# Altium project APC1_Wireless.PrjPcb
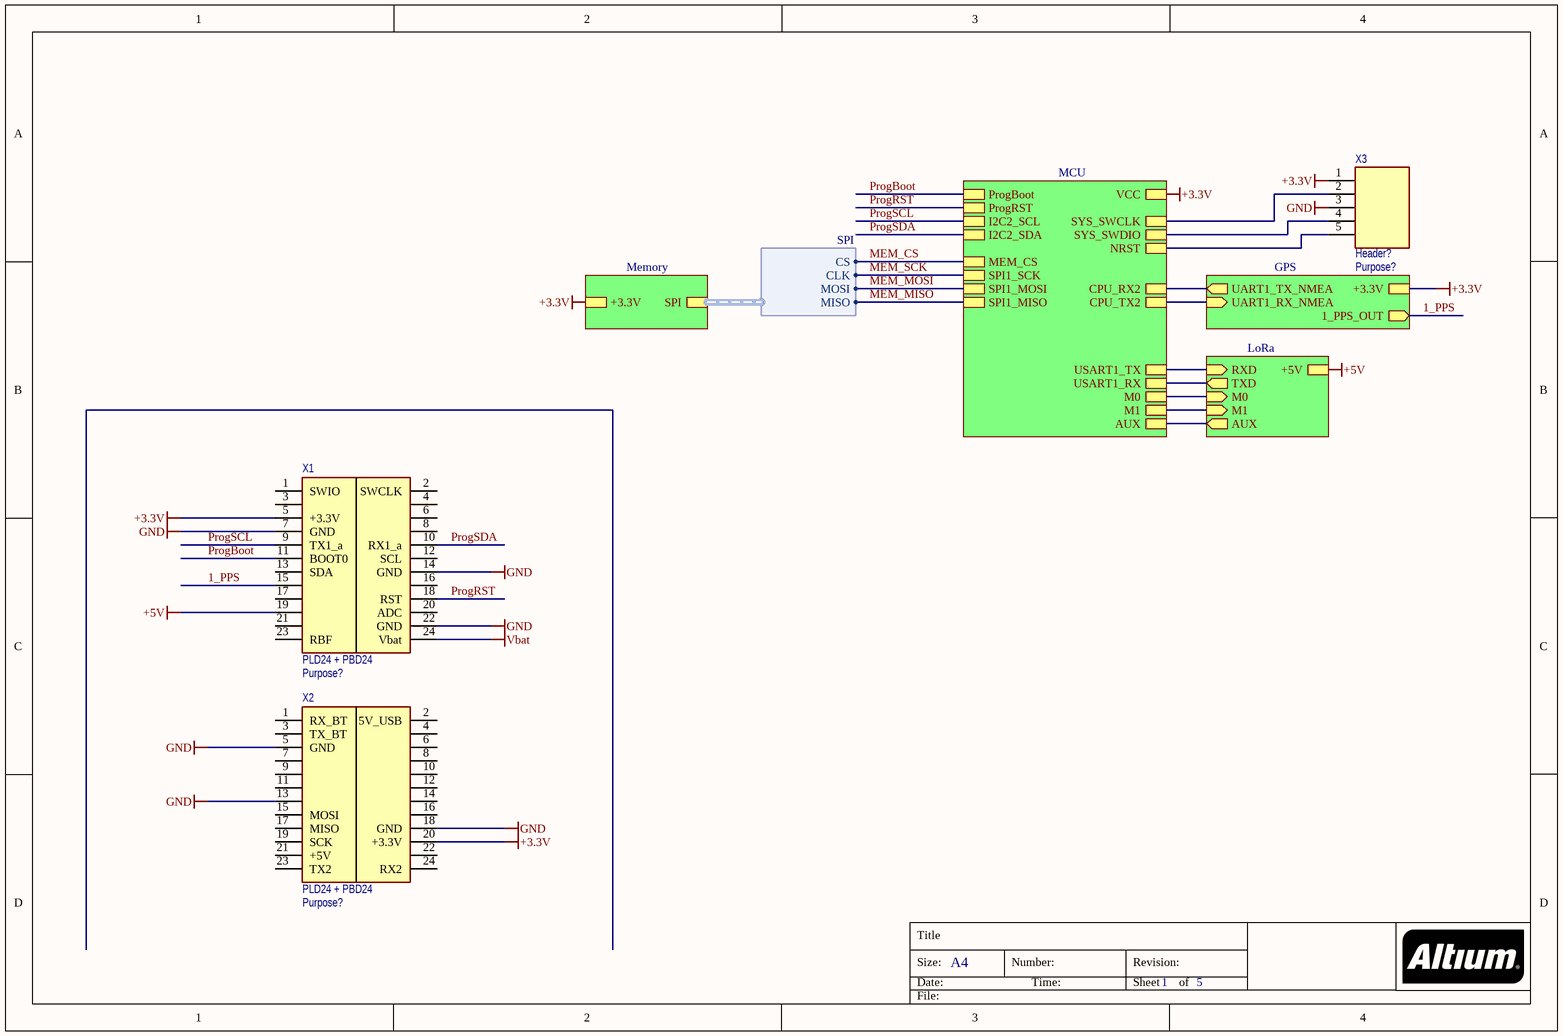
[diagram p0: APC1_Wireless.SchDoc]
5 sheets, 23 parts. Net scope: hierarchical (ports join the sheet entries above them; power ports are global).
Board file: APC1_Wireless.PcbDoc
Sheets:
  APC1_Wireless.SchDoc
    GPS = GPS.SchDoc
    Memory = Memory.SchDoc
    LoRa = LoRa.SchDoc
    MCU = MCU.SchDoc

## Sheet APC1_Wireless.SchDoc: =GlobalProjectName
size A4; ApprovedBy: Утвердил; CheckedBy: Проверил; Author: Разработал; SheetNumber: 1; SheetTotal: 5; PageSetup: Record=PageOptions|CenterHorizontal=True|CenterVertical=True|PrintScale=1.00|XCorrection=1.00|YCorrection=1.00|PrintKind=1|BorderSize=5000000|LeftOffset=0|BottomOffset=0|Orientation=2|PaperLength=1000|PaperWidth=1000|Scale=100|PaperSource=15|PrintQuality=1200|MediaType=1|DitherType=10|PaperKind=A3|PrintScaleMode=1; Weight: -; ScaleFactor: -; NormInspection: Норм.Контр.

### Parts
X1  PLD24 + PBD24  Purpose: Purpose?  [PICOSAT_CNN]
X2  PLD24 + PBD24  Purpose: Purpose?  [PICOSAT_CNN]
X3  Header?  Purpose: Purpose?  [PLS-5R-2.54]

### Sub-sheets
GPS = GPS.SchDoc: 1_PPS_OUT (out), UART1_TX_NMEA (out), UART1_RX_NMEA (in), +3.3V
LoRa = LoRa.SchDoc: M0 (in), RXD (in), M1 (in), TXD (out), AUX (out), +5V
MCU = MCU.SchDoc: VCC, ProgBoot, ProgRST, CPU_RX2, MEM_CS, SPI1_SCK, SPI1_MISO, SPI1_MOSI, SYS_SWDIO, AUX, USART1_TX, USART1_RX, SYS_SWCLK, M0, M1, NRST, CPU_TX2, I2C2_SDA, I2C2_SCL
Memory = Memory.SchDoc: SPI (harness SPI), +3.3V

### Harnesses
SPI: CS, CLK, MOSI, MISO

### Nets
+3.3V: X1.5(+3.3V) X2.20(+3.3V) X3.1 ; sheet GPS/+3.3V, sheet Memory/+3.3V, sheet MCU/VCC
+5V: X1.19 ; sheet LoRa/+5V
GND: X1.7(GND) X1.14(GND) X1.22(GND) X2.5(GND) X2.13 X2.18(GND) X3.3
Vbat: X1.24(Vbat)
1_PPS: X1.15 ; sheet GPS/1_PPS_OUT
AUX: sheet LoRa/AUX, sheet MCU/AUX
M0: sheet LoRa/M0, sheet MCU/M0
M1: sheet LoRa/M1, sheet MCU/M1
MEM_CS: sheet MCU/MEM_CS, sheet Memory/SPI.CS
MEM_MISO: sheet MCU/SPI1_MISO, sheet Memory/SPI.MISO
MEM_MOSI: sheet MCU/SPI1_MOSI, sheet Memory/SPI.MOSI
MEM_SCK: sheet MCU/SPI1_SCK, sheet Memory/SPI.CLK
ProgBoot: X1.11(BOOT0) ; sheet MCU/ProgBoot
ProgRST: X1.18(RST) ; sheet MCU/ProgRST
ProgSCL: X1.9(TX1_a) ; sheet MCU/I2C2_SCL  [project net I2C2_SCL]
ProgSDA: X1.10(RX1_a) ; sheet MCU/I2C2_SDA  [project net I2C2_SDA]
SYS_SWCLK: X3.2 ; sheet MCU/SYS_SWCLK
SYS_SWDIO: X3.4 ; sheet MCU/SYS_SWDIO
USART1_RX: sheet LoRa/TXD, sheet MCU/USART1_RX
USART1_TX: sheet LoRa/RXD, sheet MCU/USART1_TX
USART2_RX: sheet GPS/UART1_TX_NMEA, sheet MCU/CPU_RX2
USART2_TX: sheet GPS/UART1_RX_NMEA, sheet MCU/CPU_TX2
NetR7_1: X3.5 ; sheet MCU/NRST

Not connected (* = marked no-connect by the designer): X1 1(SWIO) 2(SWCLK) 3 4 6 8 12(SCL) 13(SDA) 16 17 20(ADC) 21 23(RBF); X2 1(RX_BT) 2(5V_USB) 3(TX_BT) 4 6 7 8 9 10 11 12 14 15(MOSI) 16 17(MISO) 19(SCK) 21(+5V) 22 23(TX2) 24(RX2)

### Notes on the sheet
- Title
- Size:
- Date:
- A4
- Number:
- Time:
- Revision:
- Sheet
- of
- File:

### Library data of the parts
X1 X2 = Header 2x12: 10x2 header; IsSMT: NoSMT
X3 = Header 1x5: 5x1 header; IsSMT: NoSMT

## Sheet GPS.SchDoc
size A4; SheetNumber: 2; SheetTotal: 5
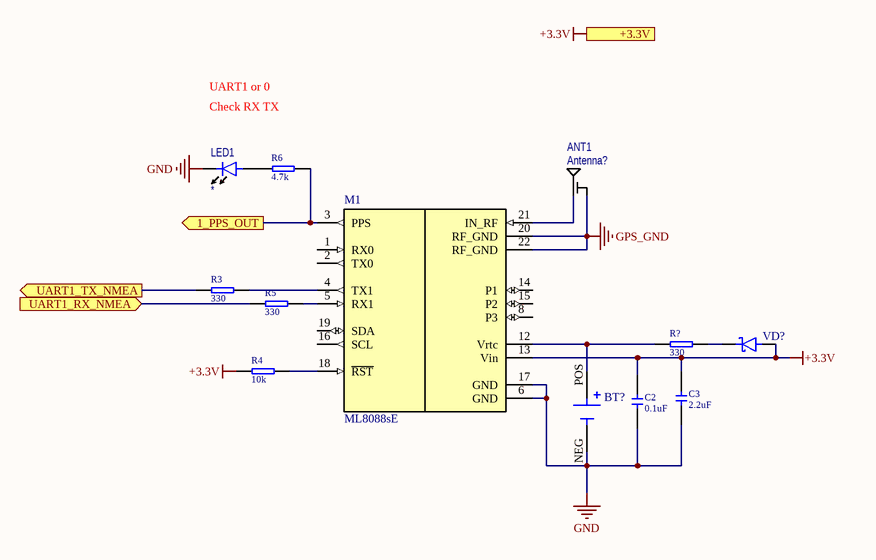
[diagram p1: GPS.SchDoc]

### Parts
ANT1  Antenna?  [IPEX-3P]
BT?  MS621FE-FL11E  [BAT_MS621FE-FL11E]  (value not drawn)
C2  value 0.1uF  [CERCAP 0402]
C3  value 2.2uF  [CERCAP 0603]
LED1  (no value)  [LED 0603]
M1  ML8088sE  [MODULE_ML8088S]
R3  value 330  [RES 0402]
R4  value 10k  [RES 0402]
R5  value 330  [RES 0402]
R6  value 4.7k  [RES 0402]
R?  value 330  [RES 0402]
VD?  (no value)  [SOD-123]

### Ports
1_PPS_OUT (out), +3.3V, UART1_RX_NMEA (in), UART1_TX_NMEA (out)

### Nets
+3.3V: C2.2 C3.2 M1.13(Vin) R4.1 VD?.A(Anode) ; port +3.3V
GND: BT?.NEG C2.1 C3.1 LED1.2(Cathode) M1.6(GND) M1.17(GND)
GPS_GND: ANT1.0 M1.20(RF_GND) M1.22(RF_GND)
1_PPS: M1.3(PPS) R6.2 ; port 1_PPS_OUT
USART2_RX: R3.1 ; port UART1_TX_NMEA
USART2_TX: R5.1 ; port UART1_RX_NMEA
NetANT1_1: ANT1.1 M1.21(IN_RF)
NetBT?_POS: BT?.POS M1.12(Vrtc) R?.1
NetLED1_1: LED1.1(Anode) R6.1
NetM1_4: M1.4(TX1) R3.2
NetM1_5: M1.5(RX1) R5.2
NetM1_18: M1.18(~{RST}) R4.2
NetR?_2: R?.2 VD?.C(Cathode)

Not connected (* = marked no-connect by the designer): M1 1(RX0) 2(TX0) 8(P3) 14(P1) 15(P2) 16(SCL) 19(SDA)

### Notes on the sheet
- UART1 or 0
- Check RX TX

### Library data of the parts
ANT1 = Antenna: HF con; IsSMT: NoSMT
BT? = MS621FE-FL11E: Coin, 6.8mm 3V Lithium Battery Rechargeable (Secondary) 5.5mAh; MF: Seiko Instruments; SnapEDA_Link: https://www.snapeda.com/parts/MS621FE-FL11E/Seiko%20Instruments/view-part/6886595/?ref=snap; MP: MS621FE-FL11E; Availability: In Stock; Price: None; Check_prices: https://www.snapeda.com/parts/MS621FE-FL11E/Seiko%20Instruments/view-part/6886595/?ref=eda; Value: *; Purchase-URL: https://pricing.snapeda.com/search/part/MS621FE-FL11E/?ref=eda; Package: QFP-128 Seiko
C2 C3 = !Capacitor: Capacitor; IsSMT: NoSMT; Diel: X7R; Voltage: *
LED1 = LED: Light Emittering Diode; IsSMT: NoSMT; Value: *
M1 = GNSS_NAVIA_ML8088sE: GNSS 50km; Order: ML8088sl
R3-R6 R? = !Resistor: Resistor; IsSMT: NoSMT
VD? = DiodeS: Diode Shottky; IsSMT: NoSMT

## Sheet Memory.SchDoc
size A4; SheetNumber: 3; SheetTotal: 4
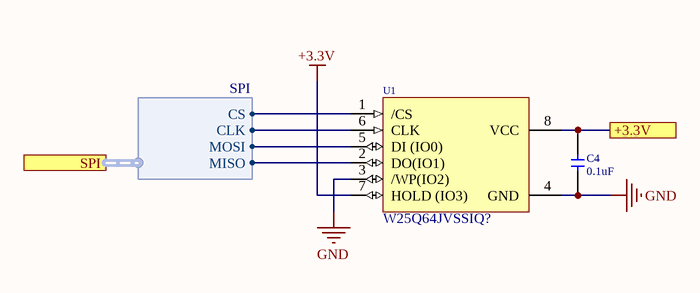
[diagram p2: Memory.SchDoc]

### Parts
C4  value 0.1uF  [CERCAP 0402]
U1  W25Q64JVSSIQ?  [SO-8]

### Ports
+3.3V, SPI (harness SPI)

### Harnesses
SPI: CS, CLK, MOSI, MISO

### Nets
+3.3V: C4.2 U1.7(HOLD_(IO3)) U1.8(VCC) ; port +3.3V
GND: C4.1 U1.3(/WP(IO2)) U1.4(GND)
MEM_CS: U1.1(/CS) ; port SPI.CS
MEM_MISO: U1.2(DO(IO1)) ; port SPI.MISO
MEM_MOSI: U1.5(DI_(IO0)) ; port SPI.MOSI
MEM_SCK: U1.6(CLK) ; port SPI.CLK

### Library data of the parts
C4 = !Capacitor: Capacitor; IsSMT: NoSMT; Diel: X7R; Voltage: *
U1 = Flash

## Sheet LoRa.SchDoc
size A4; SheetNumber: 5; SheetTotal: 5
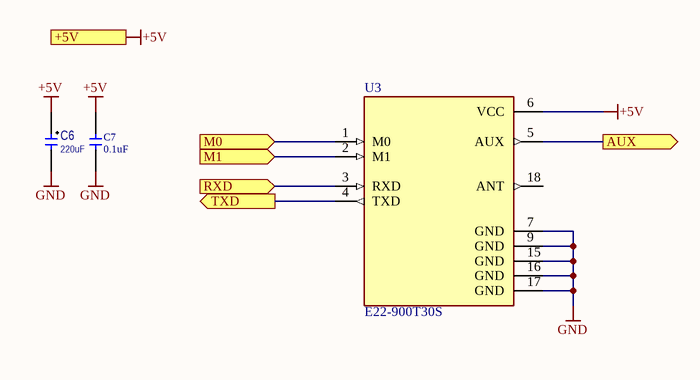
[diagram p3: LoRa.SchDoc]

### Parts
C6  value 220uF  [TECAP C]
C7  value 0.1uF  [CERCAP 0402]
U3  E22-900T30S  [E22-900T30S]

### Ports
+5V, AUX (out), M0 (in), M1 (in), RXD (in), TXD (out)

### Nets
+5V: C6.1(+) C7.2 U3.6(VCC) ; port +5V
GND: C6.2(-) C7.1 U3.7(GND) U3.9(GND) U3.15(GND) U3.16(GND) U3.17(GND)
AUX: U3.5(AUX) ; port AUX
M0: U3.1(M0) ; port M0
M1: U3.2(M1) ; port M1
USART1_RX: U3.4(TXD) ; port TXD
USART1_TX: U3.3(RXD) ; port RXD

Not connected (* = marked no-connect by the designer): U3 18(ANT)

### Library data of the parts
C6 = CapacitorP: Capacitor Polar; IsSMT: NoSMT; Diel: X7R; Voltage: *
C7 = !Capacitor: Capacitor; IsSMT: NoSMT; Diel: X7R; Voltage: *
U3 = E22-900T30S: LORA RF

## Sheet MCU.SchDoc
size A4; SheetNumber: 4; SheetTotal: 5
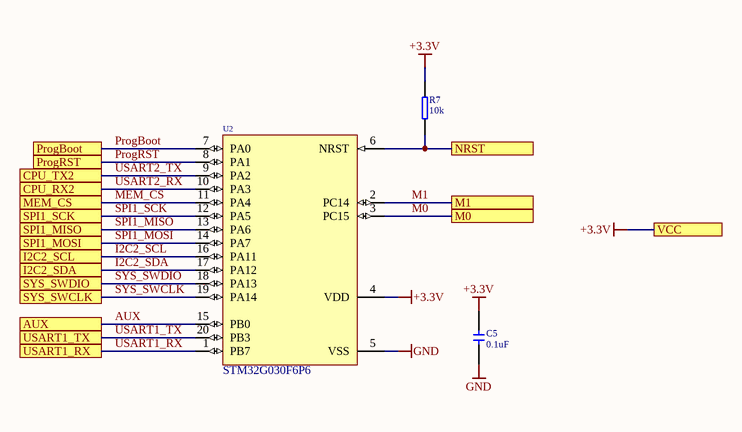
[diagram p4: MCU.SchDoc]

### Parts
C5  value 0.1uF  [CERCAP 0402]
R7  value 10k  [RES 0402]
U2  STM32G030F6P6  [TSSOP-20]

### Ports
AUX, CPU_RX2, CPU_TX2, I2C2_SCL, I2C2_SDA, M0, M1, MEM_CS, NRST, ProgBoot, ProgRST, SPI1_MISO, SPI1_MOSI, SPI1_SCK, SYS_SWCLK, SYS_SWDIO, USART1_RX, USART1_TX, VCC

### Nets
+3.3V: C5.2 R7.2 U2.4(VDD) ; port VCC
GND: C5.1 U2.5(VSS)
AUX: U2.15(PB0) ; port AUX
I2C2_SCL: U2.16(PA11) ; port I2C2_SCL
I2C2_SDA: U2.17(PA12) ; port I2C2_SDA
M0: U2.3(PC15) ; port M0
M1: U2.2(PC14) ; port M1
MEM_CS: U2.11(PA4) ; port MEM_CS
ProgBoot: U2.7(PA0) ; port ProgBoot
ProgRST: U2.8(PA1) ; port ProgRST
SPI1_MISO: U2.13(PA6) ; port SPI1_MISO  [project net MEM_MISO]
SPI1_MOSI: U2.14(PA7) ; port SPI1_MOSI  [project net MEM_MOSI]
SPI1_SCK: U2.12(PA5) ; port SPI1_SCK  [project net MEM_SCK]
SYS_SWCLK: U2.19(PA14) ; port SYS_SWCLK
SYS_SWDIO: U2.18(PA13) ; port SYS_SWDIO
USART1_RX: U2.1(PB7) ; port USART1_RX
USART1_TX: U2.20(PB3) ; port USART1_TX
USART2_RX: U2.10(PA3) ; port CPU_RX2
USART2_TX: U2.9(PA2) ; port CPU_TX2
NetR7_1: R7.1 U2.6(NRST) ; port NRST

### Library data of the parts
C5 = !Capacitor: Capacitor; IsSMT: NoSMT; Diel: X7R; Voltage: *
R7 = !Resistor: Resistor; IsSMT: NoSMT
U2 = STM32G030F6P6: Cortex-M0+

## Nets that join several sheets
+3.3V: APC1_Wireless (X1.5 X2.20 X3.1), GPS (5 pins), Memory (C4.2 U1.7 U1.8), MCU (C5.2 R7.2 U2.4)
+5V: APC1_Wireless (X1.19), LoRa (C6.1 C7.2 U3.6)
GND: APC1_Wireless (7 pins), GPS (6 pins), Memory (C4.1 U1.3 U1.4), LoRa (7 pins), MCU (C5.1 U2.5)
1_PPS: APC1_Wireless (X1.15), GPS (M1.3 R6.2)
AUX: LoRa (U3.5), MCU (U2.15)
I2C2_SCL: APC1_Wireless (X1.9), MCU (U2.16)
I2C2_SDA: APC1_Wireless (X1.10), MCU (U2.17)
M0: LoRa (U3.1), MCU (U2.3)
M1: LoRa (U3.2), MCU (U2.2)
MEM_CS: Memory (U1.1), MCU (U2.11)
MEM_MISO: Memory (U1.2), MCU (U2.13)
MEM_MOSI: Memory (U1.5), MCU (U2.14)
MEM_SCK: Memory (U1.6), MCU (U2.12)
NetR7_1: APC1_Wireless (X3.5), MCU (R7.1 U2.6)
ProgBoot: APC1_Wireless (X1.11), MCU (U2.7)
ProgRST: APC1_Wireless (X1.18), MCU (U2.8)
SYS_SWCLK: APC1_Wireless (X3.2), MCU (U2.19)
SYS_SWDIO: APC1_Wireless (X3.4), MCU (U2.18)
USART1_RX: LoRa (U3.4), MCU (U2.1)
USART1_TX: LoRa (U3.3), MCU (U2.20)
USART2_RX: GPS (R3.1), MCU (U2.10)
USART2_TX: GPS (R5.1), MCU (U2.9)